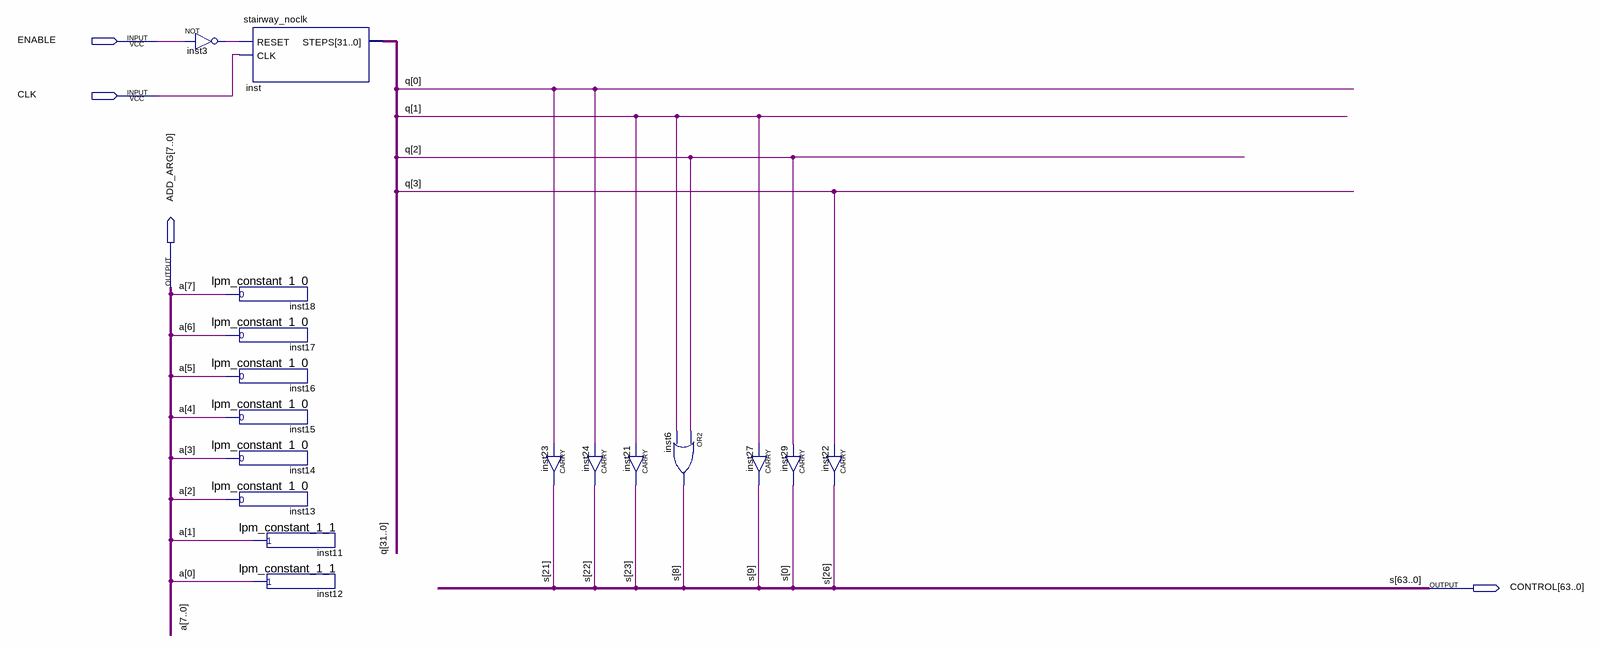
[diagram p0: schematic sheet]
// Quartus schematic macro_next.bdf as structural Verilog: 17 symbols, 4 pins
module macro_next (
  input  ENABLE,
  input  CLK,
  output [7:0] ADD_ARG,
  output [63:0] CONTROL
);

  wire inst3_out;
  wire [31:0] q;

  not inst3 (inst3_out, ENABLE);
  lpm_constant_1_0 inst18 (.result(ADD_ARG[7]));
  lpm_constant_1_0 inst17 (.result(ADD_ARG[6]));
  lpm_constant_1_0 inst16 (.result(ADD_ARG[5]));
  lpm_constant_1_0 inst15 (.result(ADD_ARG[4]));
  lpm_constant_1_0 inst14 (.result(ADD_ARG[3]));
  lpm_constant_1_0 inst13 (.result(ADD_ARG[2]));
  stairway_noclk inst (.RESET(inst3_out), .CLK(CLK), .STEPS(q));
  lpm_constant_1_1 inst11 (.result(ADD_ARG[1]));
  lpm_constant_1_1 inst12 (.result(ADD_ARG[0]));
  CARRY inst23 (.IN(q[0]), .OUT(CONTROL[21]));
  CARRY inst24 (.IN(q[0]), .OUT(CONTROL[22]));
  or inst6 (CONTROL[8], q[2], q[1]);
  CARRY inst21 (.IN(q[1]), .OUT(CONTROL[23]));
  CARRY inst27 (.IN(q[1]), .OUT(CONTROL[9]));
  CARRY inst22 (.IN(q[3]), .OUT(CONTROL[26]));
  CARRY inst29 (.IN(q[2]), .OUT(CONTROL[0]));

  // Other names for the same wires on the sheet: a[7:0] = ADD_ARG; s[63:0] = CONTROL
endmodule
